# Altium schematic sheet PolySomeCrypto01.SchDoc: PolySomeCrypto01
size A3; Revision: V1; SheetNumber: 1; SheetTotal: 8; DocumentName: PolysomeCrypto01; ProjectName: POLYSOME CRYPTO 01
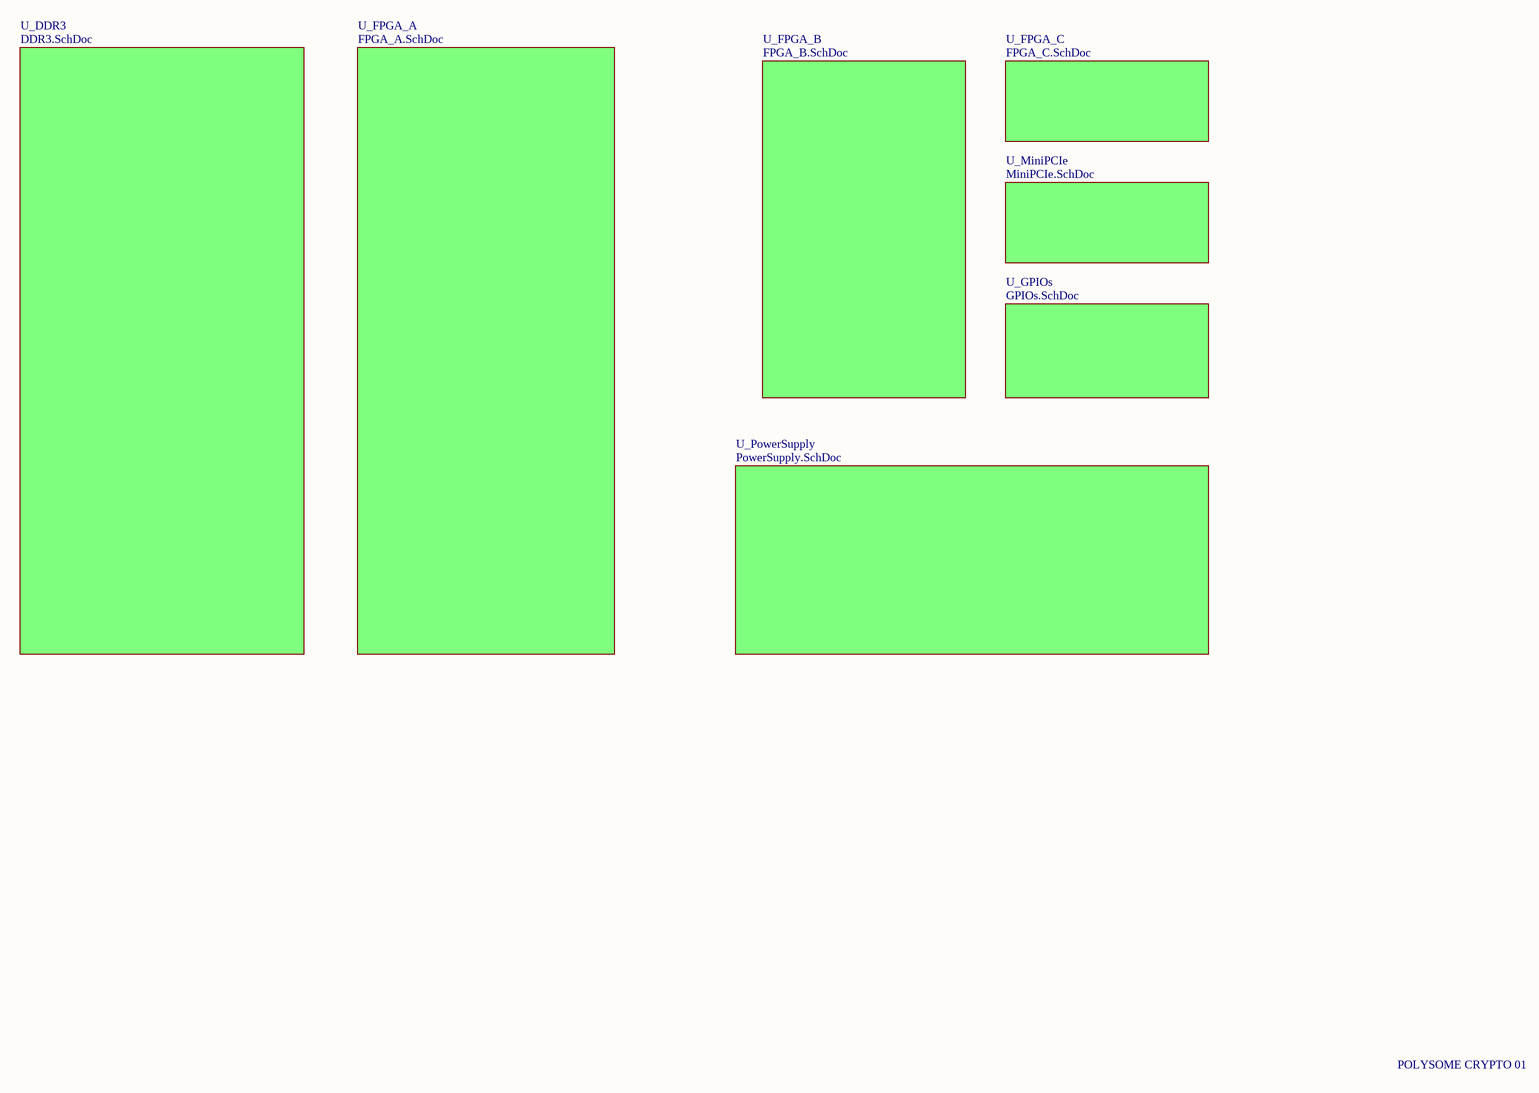
[diagram p0: PolySomeCrypto01.SchDoc]

## Sub-sheets
U_DDR3 = DDR3.SchDoc: no entries
U_FPGA_A = FPGA_A.SchDoc: no entries
U_FPGA_B = FPGA_B.SchDoc: no entries
U_FPGA_C = FPGA_C.SchDoc: no entries
U_GPIOs = GPIOs.SchDoc: no entries
U_MiniPCIe = MiniPCIe.SchDoc: no entries
U_PowerSupply = PowerSupply.SchDoc: no entries

## Notes on the sheet
- POLYSOME CRYPTO 01